# Altium project Controller.PrjPcb
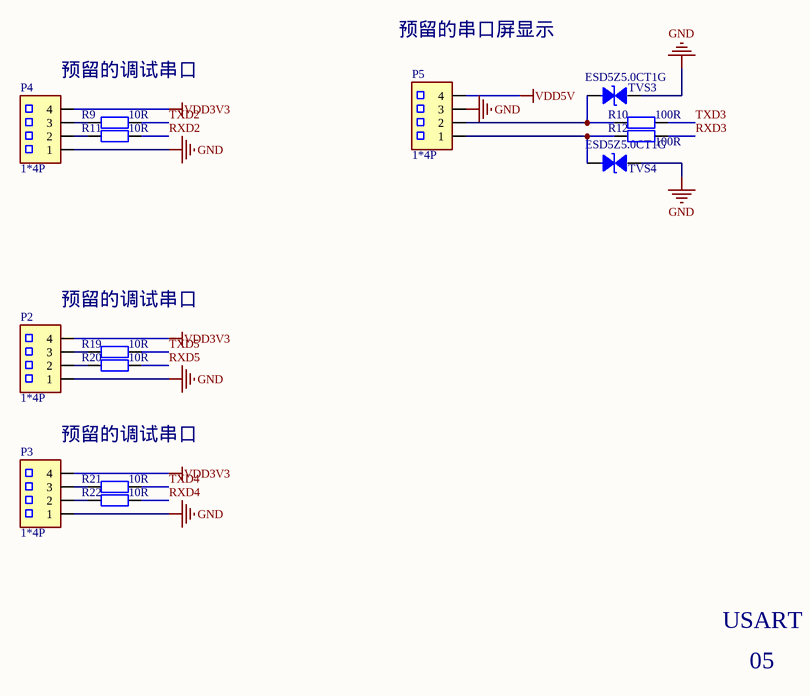
[diagram p0: 05_USART.SchDoc]
3 sheets, 14 parts. Net scope: global (net labels, ports and power ports of the same name join across sheets).
Board file: 电解模块主控板_V1.1_ZM_20211015.PcbDoc
Sheets:
  05_USART.SchDoc
  10_Wifi.SchDoc
  15_LCD.SchDoc

## Sheet 05_USART.SchDoc
size A4

### Parts
P2  1*4P  [XH2.54-4A]
P3  1*4P  [XH2.54-4A]
P4  1*4P  [XH2.54-4A]
P5  1*4P  [XH2.54-4A]
R9  10R  [SMD-0603]
R10  100R  [SMD-0603]
R11  10R  [SMD-0603]
R12  100R  [SMD-0603]
R19  10R  [SMD-0603]
R20  10R  [SMD-0603]
R21  10R  [SMD-0603]
R22  10R  [SMD-0603]
TVS3  ESD5Z5.0CT1G  [SOD-523]
TVS4  ESD5Z5.0CT1G  [SOD-523]

### Nets
GND: P2.1 P3.1 P4.1 P5.3 TVS3.1(A) TVS4.1(A)
VDD3V3: P2.4 P3.4 P4.4
VDD5V: P5.4
RXD2: R11.2
RXD3: R12.2
RXD4: R22.2
RXD5: R20.2
TXD2: R9.2
TXD3: R10.2
TXD4: R21.2
TXD5: R19.2
NetP2_2: P2.2 R20.1
NetP2_3: P2.3 R19.1
NetP3_2: P3.2 R22.1
NetP3_3: P3.3 R21.1
NetP4_2: P4.2 R11.1
NetP4_3: P4.3 R9.1
NetP5_1: P5.1 R12.1 TVS4.2(B)
NetP5_2: P5.2 R10.1 TVS3.2(B)

### Notes on the sheet
- 预留的调试串口
- 预留的串口屏显示
- USART
- 05

### Library data of the parts
P2-P5 = HDR1*4
R9-R12 R19-R22 = RES2: 贴片电阻 5%
TVS3 TVS4 = TVS-1: TVS

## Sheet 10_Wifi.SchDoc
size A4
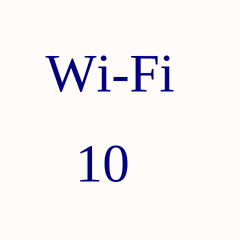
[diagram p1: 10_Wifi.SchDoc]

### Notes on the sheet
- Wi-Fi
- 10

## Sheet 15_LCD.SchDoc
size A4
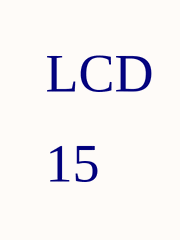
[diagram p2: 15_LCD.SchDoc]

### Notes on the sheet
- LCD
- 15